# Altium project QUTMS_Shutdownboard_V2_1.PrjPcb (part 2 of 2)
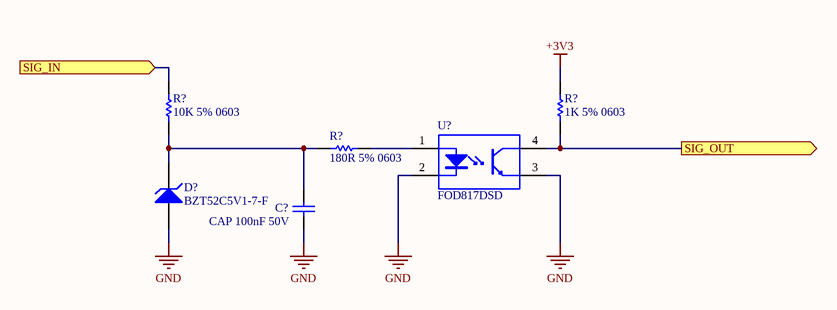
[diagram p8: 12VInputProtection.SchDoc]

## Nets that join several sheets
+3V3: MCU (11 pins), SHDN_RESET_PROTECTION (R?_SHDN_RESET_PROTECTION#2.2), SHDN_RESET_PROTECTION (R?_SHDN_RESET_PROTECTION#5.2), SHDN_RESET_PROTECTION (R?_SHDN_RESET_PROTECTION#8.2), SHDN_RESET_PROTECTION (R?_SHDN_RESET_PROTECTION#11.2), SHDN_RESET_PROTECTION (R?_SHDN_RESET_PROTECTION#14.2), SHDN_RESET_PROTECTION (R?_SHDN_RESET_PROTECTION#17.2)
+5: Demux (7 pins), ShutdownLoop (6 pins), Power (5 pins)
GND: Demux (32 pins), Connector (J?.A5), ShutdownLoop (R64.1 U20.3 U21.3), SHDN_LOOP/SHDN_SEG1 (D38_SHDN_SEG1.1 DS11_SHDN_SEG1.2 J1_SHDN_SEG1.12 Q2_SHDN_SEG1.2), SHDN_LOOP/SHDN_SEG2 (D38_SHDN_SEG2.1 DS11_SHDN_SEG2.2 J1_SHDN_SEG2.12 Q2_SHDN_SEG2.2), SHDN_LOOP/SHDN_SEG3 (D38_SHDN_SEG3.1 DS11_SHDN_SEG3.2 J1_SHDN_SEG3.12 Q2_SHDN_SEG3.2), SHDN_LOOP/SHDN_SEG4 (D38_SHDN_SEG4.1 DS11_SHDN_SEG4.2 J1_SHDN_SEG4.12 Q2_SHDN_SEG4.2), SHDN_LOOP/SHDN_SEG5 (D38_SHDN_SEG5.1 DS11_SHDN_SEG5.2 J1_SHDN_SEG5.12 Q2_SHDN_SEG5.2), SHDN_LOOP/SHDN_SEG6 (D38_SHDN_SEG6.1 DS11_SHDN_SEG6.2 J1_SHDN_SEG6.12 Q2_SHDN_SEG6.2), MCU (14 pins), Power (8 pins), SHDN_RESET_PROTECTION (C?_SHDN_RESET_PROTECTION#1.2 D?_SHDN_RESET_PROTECTION#1.1 U?_SHDN_RESET_PROTECTION#1.2 U?_SHDN_RESET_PROTECTION#1.3), SHDN_RESET_PROTECTION (C?_SHDN_RESET_PROTECTION#2.2 D?_SHDN_RESET_PROTECTION#2.1 U?_SHDN_RESET_PROTECTION#2.2 U?_SHDN_RESET_PROTECTION#2.3), SHDN_RESET_PROTECTION (C?_SHDN_RESET_PROTECTION#3.2 D?_SHDN_RESET_PROTECTION#3.1 U?_SHDN_RESET_PROTECTION#3.2 U?_SHDN_RESET_PROTECTION#3.3), SHDN_RESET_PROTECTION (C?_SHDN_RESET_PROTECTION#4.2 D?_SHDN_RESET_PROTECTION#4.1 U?_SHDN_RESET_PROTECTION#4.2 U?_SHDN_RESET_PROTECTION#4.3), SHDN_RESET_PROTECTION (C?_SHDN_RESET_PROTECTION#5.2 D?_SHDN_RESET_PROTECTION#5.1 U?_SHDN_RESET_PROTECTION#5.2 U?_SHDN_RESET_PROTECTION#5.3), SHDN_RESET_PROTECTION (C?_SHDN_RESET_PROTECTION#6.2 D?_SHDN_RESET_PROTECTION#6.1 U?_SHDN_RESET_PROTECTION#6.2 U?_SHDN_RESET_PROTECTION#6.3)
VCC: Connector (J?.A8), Power (D34.2 Q1.4)
BMS_IN_VCC: Connector (J?.A10), SHDN_RESET_PROTECTION (R?_SHDN_RESET_PROTECTION#10.1)
CAN_N: Connector (J?.A6), MCU (D?.2 R?#3.1 U?#2.6)
CAN_P: Connector (J?.A7), MCU (D?.1 R?#3.2 U?#2.7)
HVD_IN_VCC: Connector (J?.A11), SHDN_RESET_PROTECTION (R?_SHDN_RESET_PROTECTION#4.1)
IMD_IN_VCC: Connector (J?.A3), SHDN_RESET_PROTECTION (R?_SHDN_RESET_PROTECTION#7.1)
PDOC_IN_VCC: Connector (J?.A4), SHDN_RESET_PROTECTION (R?_SHDN_RESET_PROTECTION#13.1)
SDC_IN_VCC: Connector (J?.A9), SHDN_RESET_PROTECTION (R?_SHDN_RESET_PROTECTION#16.1)
SHDN_IN1: Connector (J?.B12), SHDN_LOOP/SHDN_SEG1 (J1_SHDN_SEG1.4 P4_SHDN_SEG1.1)
SHDN_IN2: SHDN_LOOP/SHDN_SEG1 (J1_SHDN_SEG1.5 P4_SHDN_SEG1.2), SHDN_LOOP/SHDN_SEG2 (J1_SHDN_SEG2.4 P4_SHDN_SEG2.1)
SHDN_IN3: SHDN_LOOP/SHDN_SEG2 (J1_SHDN_SEG2.5 P4_SHDN_SEG2.2), SHDN_LOOP/SHDN_SEG3 (J1_SHDN_SEG3.4 P4_SHDN_SEG3.1)
SHDN_IN4: SHDN_LOOP/SHDN_SEG3 (J1_SHDN_SEG3.5 P4_SHDN_SEG3.2), SHDN_LOOP/SHDN_SEG4 (J1_SHDN_SEG4.4 P4_SHDN_SEG4.1)
SHDN_IN5: SHDN_LOOP/SHDN_SEG4 (J1_SHDN_SEG4.5 P4_SHDN_SEG4.2), SHDN_LOOP/SHDN_SEG5 (J1_SHDN_SEG5.4 P4_SHDN_SEG5.1)
SHDN_IN6: SHDN_LOOP/SHDN_SEG5 (J1_SHDN_SEG5.5 P4_SHDN_SEG5.2), SHDN_LOOP/SHDN_SEG6 (J1_SHDN_SEG6.4 P4_SHDN_SEG6.1)
SHDN_OUT6: Connector (J?.B1), SHDN_LOOP/SHDN_SEG6 (J1_SHDN_SEG6.5 P4_SHDN_SEG6.2)
SHDN_SEG_LATCH: ShutdownLoop (U20.2 U21.4), SHDN_LOOP/SHDN_SEG1 (Q2_SHDN_SEG1.1), SHDN_LOOP/SHDN_SEG2 (Q2_SHDN_SEG2.1), SHDN_LOOP/SHDN_SEG3 (Q2_SHDN_SEG3.1), SHDN_LOOP/SHDN_SEG4 (Q2_SHDN_SEG4.1), SHDN_LOOP/SHDN_SEG5 (Q2_SHDN_SEG5.1), SHDN_LOOP/SHDN_SEG6 (Q2_SHDN_SEG6.1), SHDN_RESET_PROTECTION (R?_SHDN_RESET_PROTECTION#2.1 U?_SHDN_RESET_PROTECTION#1.4)
SHUTDOWN_RESET: Connector (J?.B11), SHDN_RESET_PROTECTION (R?_SHDN_RESET_PROTECTION#1.1)
STATE_TRIGGER1: SHDN_LOOP/SHDN_SEG1 (J1_SHDN_SEG1.9 K2_SHDN_SEG1.4), SHDN_RESET_PROTECTION (R?_SHDN_RESET_PROTECTION#5.1 U?_SHDN_RESET_PROTECTION#2.4)
STATE_TRIGGER2: SHDN_LOOP/SHDN_SEG2 (J1_SHDN_SEG2.9 K2_SHDN_SEG2.4), SHDN_RESET_PROTECTION (R?_SHDN_RESET_PROTECTION#8.1 U?_SHDN_RESET_PROTECTION#3.4)
STATE_TRIGGER3: SHDN_LOOP/SHDN_SEG3 (J1_SHDN_SEG3.9 K2_SHDN_SEG3.4), SHDN_RESET_PROTECTION (R?_SHDN_RESET_PROTECTION#11.1 U?_SHDN_RESET_PROTECTION#4.4)
STATE_TRIGGER4: SHDN_LOOP/SHDN_SEG4 (J1_SHDN_SEG4.9 K2_SHDN_SEG4.4), SHDN_RESET_PROTECTION (R?_SHDN_RESET_PROTECTION#14.1 U?_SHDN_RESET_PROTECTION#5.4)
STATE_TRIGGER6: SHDN_LOOP/SHDN_SEG6 (J1_SHDN_SEG6.9 K2_SHDN_SEG6.4), SHDN_RESET_PROTECTION (R?_SHDN_RESET_PROTECTION#17.1 U?_SHDN_RESET_PROTECTION#6.4)